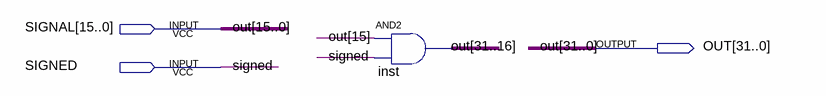
[diagram p0: schematic sheet]
// Quartus schematic SignExt.bdf as structural Verilog: 1 symbols, 3 pins
module SignExt (
  input  [15:0] SIGNAL,
  input  SIGNED,
  output [31:0] OUT
);

  assign OUT[31:16] = {16{SIGNAL[15]}} & {16{SIGNED}};  // AND2 inst, 16 bits wide

  assign OUT[15:0] = SIGNAL;
endmodule
